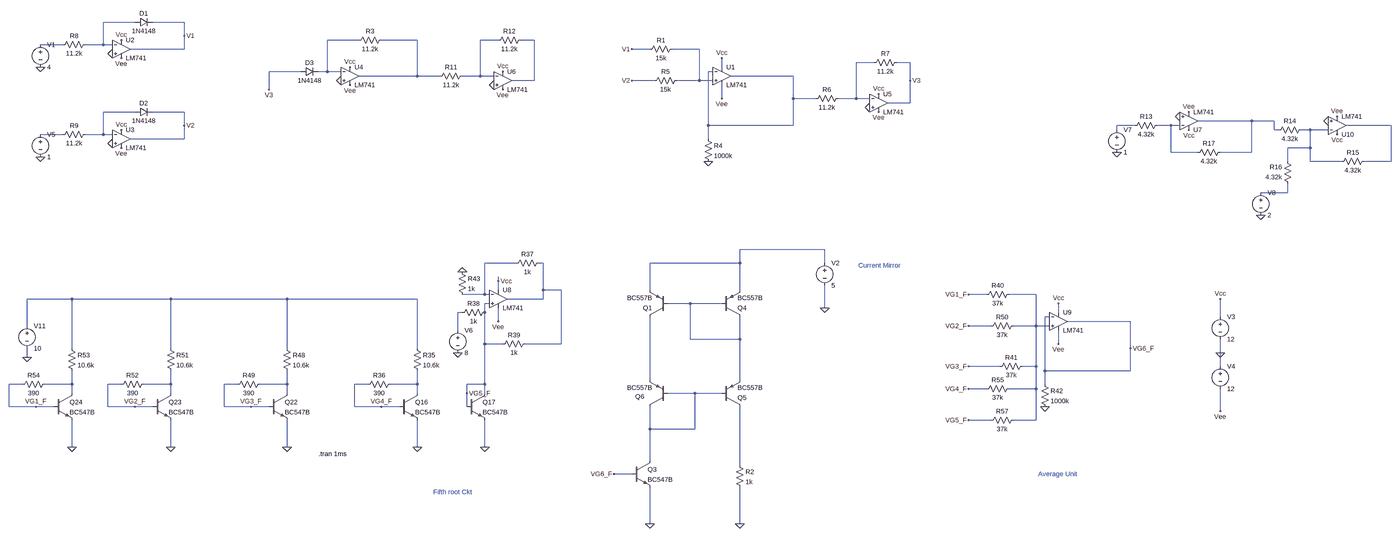
[diagram p0: schematic Nth Root.asc, whole sheet]
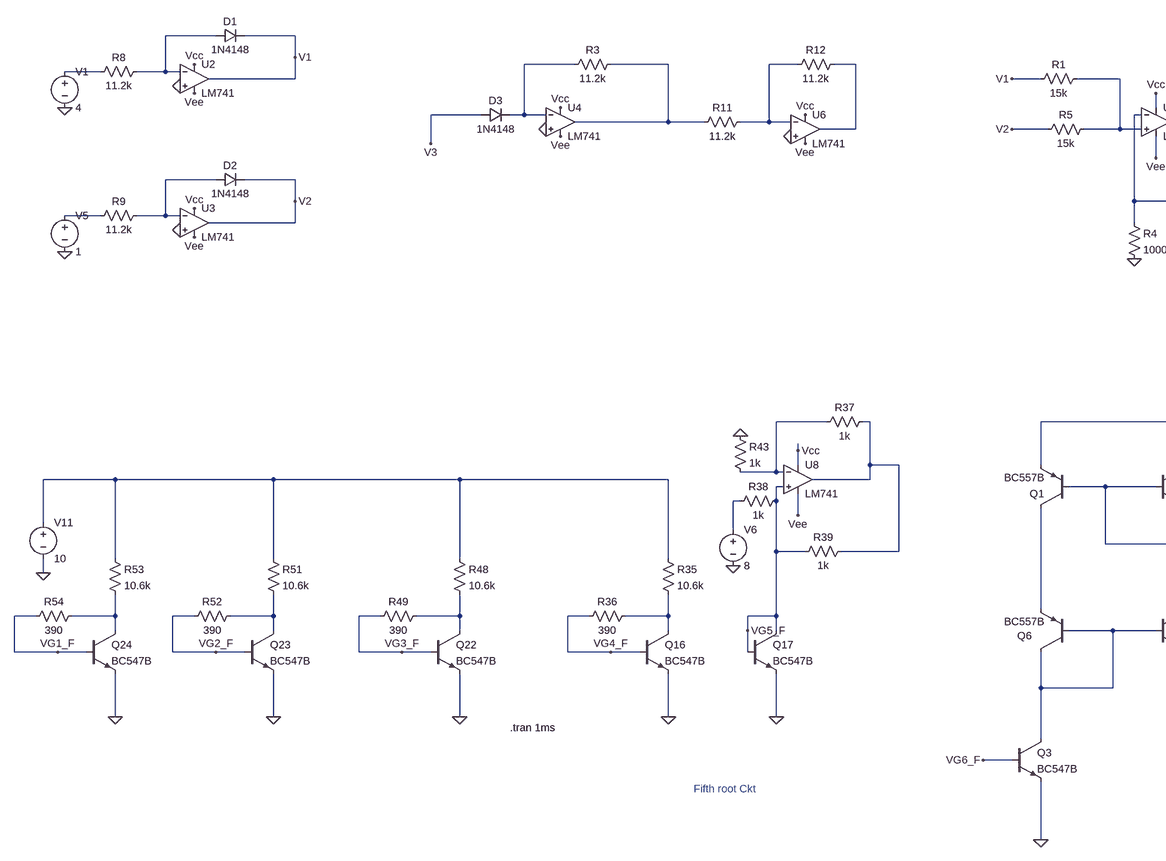
[diagram p1: schematic Nth Root.asc, part, row 1 of 1, column 1 of 2]
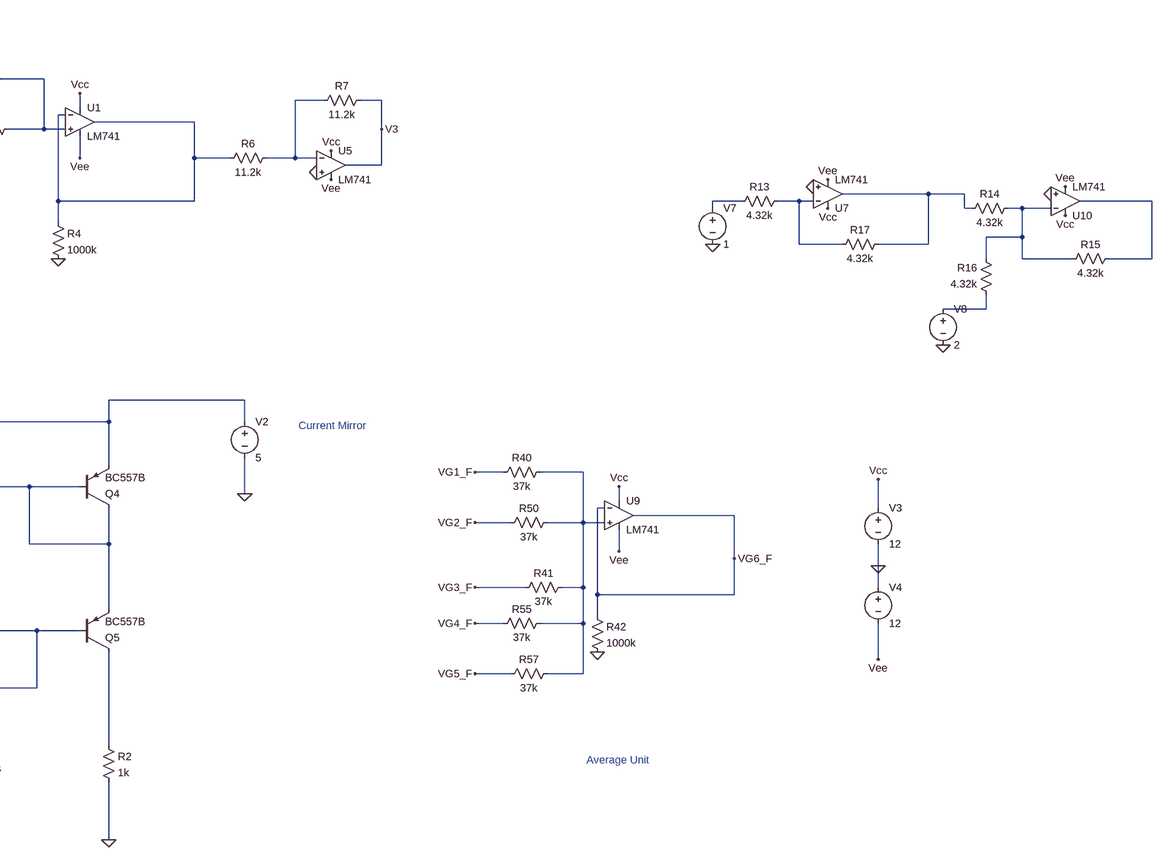
[diagram p2: schematic Nth Root.asc, part, row 1 of 1, column 2 of 2]
Nth Root.asc, the LTspice schematic file:
Version 4
SHEET 1 7272 1028
WIRE -2224 -4416 -2336 -4416
WIRE -2048 -4416 -2160 -4416
WIRE -2048 -4368 -2048 -4416
WIRE -1408 -4352 -1520 -4352
WIRE -1200 -4352 -1328 -4352
WIRE -912 -4352 -976 -4352
WIRE -784 -4352 -832 -4352
WIRE -2480 -4336 -2560 -4336
WIRE -2336 -4336 -2336 -4416
WIRE -2336 -4336 -2400 -4336
WIRE -2304 -4336 -2336 -4336
WIRE -2048 -4320 -2048 -4368
WIRE -2048 -4320 -2240 -4320
WIRE -304 -4320 -368 -4320
WIRE -128 -4320 -224 -4320
WIRE 496 -4272 432 -4272
WIRE 624 -4272 576 -4272
WIRE -48 -4256 -48 -4288
WIRE -1616 -4240 -1728 -4240
WIRE -1520 -4240 -1520 -4352
WIRE -1520 -4240 -1552 -4240
WIRE -1472 -4240 -1520 -4240
WIRE -80 -4240 -96 -4240
WIRE -1200 -4224 -1200 -4352
WIRE -1200 -4224 -1408 -4224
WIRE -1120 -4224 -1200 -4224
WIRE -976 -4224 -976 -4352
WIRE -976 -4224 -1040 -4224
WIRE -928 -4224 -976 -4224
WIRE 208 -4224 -16 -4224
WIRE -784 -4208 -784 -4352
WIRE -784 -4208 -864 -4208
WIRE -288 -4208 -368 -4208
WIRE -128 -4208 -128 -4320
WIRE -128 -4208 -208 -4208
WIRE -80 -4208 -128 -4208
WIRE 624 -4208 624 -4272
WIRE -1728 -4176 -1728 -4240
WIRE -48 -4144 -48 -4192
WIRE 208 -4144 208 -4224
WIRE 288 -4144 208 -4144
WIRE 432 -4144 432 -4272
WIRE 432 -4144 368 -4144
WIRE 480 -4144 432 -4144
WIRE 624 -4128 624 -4208
WIRE 624 -4128 544 -4128
WIRE -2224 -4096 -2336 -4096
WIRE -2048 -4096 -2160 -4096
WIRE 1840 -4064 1648 -4064
WIRE 1920 -4064 1840 -4064
WIRE -2048 -4048 -2048 -4096
WIRE -96 -4048 -96 -4240
WIRE 208 -4048 208 -4144
WIRE 208 -4048 -96 -4048
WIRE 1424 -4048 1360 -4048
WIRE 1552 -4048 1504 -4048
WIRE 1584 -4048 1552 -4048
WIRE 2336 -4048 2176 -4048
WIRE 1360 -4032 1360 -4048
WIRE 1920 -4032 1920 -4064
WIRE 1936 -4032 1920 -4032
WIRE 2048 -4032 2016 -4032
WIRE 2112 -4032 2048 -4032
WIRE -2480 -4016 -2560 -4016
WIRE -2336 -4016 -2336 -4096
WIRE -2336 -4016 -2400 -4016
WIRE -2304 -4016 -2336 -4016
WIRE -2048 -4000 -2048 -4048
WIRE -2048 -4000 -2240 -4000
WIRE -96 -4000 -96 -4048
WIRE 2048 -3968 2048 -4032
WIRE 2048 -3968 1968 -3968
WIRE 1552 -3952 1552 -4048
WIRE 1648 -3952 1552 -3952
WIRE 1840 -3952 1840 -4064
WIRE 1840 -3952 1728 -3952
WIRE 1968 -3920 1968 -3968
WIRE 2048 -3920 2048 -3968
WIRE 2160 -3920 2048 -3920
WIRE 2336 -3920 2336 -4048
WIRE 2336 -3920 2240 -3920
WIRE 1968 -3808 1968 -3840
WIRE 1968 -3808 1872 -3808
WIRE 320 -2912 16 -2912
WIRE -848 -2864 -960 -2864
WIRE -752 -2864 -768 -2864
WIRE 16 -2864 16 -2912
WIRE 16 -2864 -304 -2864
WIRE 320 -2864 320 -2912
WIRE -912 -2800 -912 -2816
WIRE -912 -2768 -912 -2800
WIRE -752 -2768 -752 -2864
WIRE -688 -2768 -752 -2768
WIRE -304 -2768 -304 -2864
WIRE 16 -2768 16 -2864
WIRE -960 -2752 -960 -2864
WIRE -960 -2752 -1040 -2752
WIRE -944 -2752 -960 -2752
WIRE 896 -2752 832 -2752
WIRE 1072 -2752 976 -2752
WIRE -2448 -2736 -2608 -2736
WIRE -2096 -2736 -2448 -2736
WIRE -1664 -2736 -2096 -2736
WIRE -1200 -2736 -1664 -2736
WIRE -752 -2736 -752 -2768
WIRE -752 -2736 -880 -2736
WIRE -944 -2720 -960 -2720
WIRE -160 -2720 -240 -2720
WIRE -48 -2720 -160 -2720
WIRE 320 -2704 320 -2784
WIRE -1040 -2688 -1056 -2688
WIRE -960 -2688 -960 -2720
WIRE 1152 -2688 1152 -2720
WIRE 1120 -2672 1104 -2672
WIRE 1728 -2672 1728 -2736
WIRE -912 -2656 -912 -2704
WIRE 1408 -2656 1184 -2656
WIRE -2608 -2640 -2608 -2736
WIRE 912 -2640 832 -2640
WIRE 1072 -2640 1072 -2752
WIRE 1072 -2640 992 -2640
WIRE 1120 -2640 1072 -2640
WIRE -1056 -2624 -1056 -2688
WIRE -160 -2592 -160 -2720
WIRE 16 -2592 16 -2672
WIRE 16 -2592 -160 -2592
WIRE -960 -2576 -960 -2688
WIRE -896 -2576 -960 -2576
WIRE -688 -2576 -688 -2768
WIRE -688 -2576 -816 -2576
WIRE 1152 -2576 1152 -2624
WIRE -2448 -2560 -2448 -2736
WIRE -2096 -2560 -2096 -2736
WIRE -1664 -2560 -1664 -2736
WIRE -1200 -2560 -1200 -2736
WIRE 1408 -2560 1408 -2656
WIRE 1728 -2544 1728 -2592
WIRE -2608 -2528 -2608 -2560
WIRE 944 -2496 832 -2496
WIRE 1072 -2496 1072 -2640
WIRE 1072 -2496 1024 -2496
WIRE 1728 -2496 1728 -2544
WIRE 1104 -2480 1104 -2672
WIRE 1408 -2480 1408 -2560
WIRE 1408 -2480 1104 -2480
WIRE -304 -2448 -304 -2672
WIRE 16 -2448 16 -2592
WIRE -2624 -2432 -2672 -2432
WIRE -2448 -2432 -2448 -2480
WIRE -2448 -2432 -2544 -2432
WIRE -2272 -2432 -2320 -2432
WIRE -2096 -2432 -2096 -2480
WIRE -2096 -2432 -2192 -2432
WIRE -1840 -2432 -1888 -2432
WIRE -1664 -2432 -1664 -2480
WIRE -1664 -2432 -1760 -2432
WIRE -1376 -2432 -1424 -2432
WIRE -1200 -2432 -1200 -2480
WIRE -1200 -2432 -1296 -2432
WIRE -960 -2432 -960 -2576
WIRE -960 -2432 -1024 -2432
WIRE 1104 -2432 1104 -2480
WIRE 896 -2416 832 -2416
WIRE 1072 -2416 1072 -2496
WIRE 1072 -2416 976 -2416
WIRE -2448 -2400 -2448 -2432
WIRE -2096 -2400 -2096 -2432
WIRE -1664 -2400 -1664 -2432
WIRE -1200 -2400 -1200 -2432
WIRE -1024 -2400 -1024 -2432
WIRE -960 -2400 -960 -2432
WIRE -144 -2400 -240 -2400
WIRE -48 -2400 -144 -2400
WIRE -2672 -2352 -2672 -2432
WIRE -2576 -2352 -2672 -2352
WIRE -2512 -2352 -2576 -2352
WIRE -2320 -2352 -2320 -2432
WIRE -2224 -2352 -2320 -2352
WIRE -2160 -2352 -2224 -2352
WIRE -1888 -2352 -1888 -2432
WIRE -1792 -2352 -1888 -2352
WIRE -1728 -2352 -1792 -2352
WIRE -1424 -2352 -1424 -2432
WIRE -1328 -2352 -1424 -2352
WIRE -1264 -2352 -1328 -2352
WIRE -1024 -2352 -1024 -2400
WIRE 1728 -2336 1728 -2416
WIRE 912 -2304 832 -2304
WIRE 1072 -2304 1072 -2416
WIRE 1072 -2304 992 -2304
WIRE -304 -2272 -304 -2352
WIRE -144 -2272 -144 -2400
WIRE -144 -2272 -304 -2272
WIRE -2448 -2208 -2448 -2304
WIRE -2096 -2208 -2096 -2304
WIRE -1664 -2208 -1664 -2304
WIRE -1200 -2208 -1200 -2304
WIRE -960 -2208 -960 -2304
WIRE -304 -2160 -304 -2272
WIRE 16 -2144 16 -2352
WIRE -368 -2112 -432 -2112
WIRE -304 -1920 -304 -2064
WIRE 16 -1920 16 -2064
FLAG 1728 -2544 0
FLAG 1728 -2736 Vcc
FLAG 1728 -2336 Vee
FLAG -1200 -2208 0
FLAG -1056 -2544 0
FLAG -912 -2800 Vcc
FLAG -912 -2656 Vee
FLAG 1152 -2720 Vcc
FLAG 1152 -2576 Vee
FLAG 1104 -2352 0
FLAG -1040 -2832 0
FLAG -1328 -2352 VG4_F
FLAG 832 -2752 VG1_F
FLAG -1024 -2400 VG5_F
FLAG 832 -2496 VG3_F
FLAG 1408 -2560 VG6_F
FLAG -2608 -2528 0
FLAG -1792 -2352 VG3_F
FLAG -1664 -2208 0
FLAG 832 -2640 VG2_F
FLAG -960 -2208 0
FLAG -2096 -2208 0
FLAG -2224 -2352 VG2_F
FLAG -2448 -2208 0
FLAG -2576 -2352 VG1_F
FLAG 832 -2416 VG4_F
FLAG 832 -2304 VG5_F
FLAG -304 -1920 0
FLAG 16 -1920 0
FLAG 320 -2704 0
FLAG -432 -2112 VG6_F
FLAG -48 -4288 Vcc
FLAG -48 -4144 Vee
FLAG -96 -3920 0
FLAG -368 -4320 V1
FLAG -368 -4208 V2
FLAG -2560 -4256 0
FLAG -2304 -4304 0
FLAG -2272 -4352 Vcc
FLAG -2272 -4288 Vee
FLAG -2560 -3936 0
FLAG -2304 -3984 0
FLAG -2272 -4032 Vcc
FLAG -2272 -3968 Vee
FLAG -2048 -4368 V1
FLAG -2048 -4048 V2
FLAG -1472 -4208 0
FLAG 480 -4112 0
FLAG 512 -4160 Vcc
FLAG 512 -4096 Vee
FLAG 624 -4208 V3
FLAG -1728 -4176 V3
FLAG -1440 -4192 Vee
FLAG -1440 -4256 Vcc
FLAG -928 -4192 0
FLAG -896 -4240 Vcc
FLAG -896 -4176 Vee
FLAG 1360 -3952 0
FLAG 1584 -4080 0
FLAG 2112 -4064 0
FLAG 1872 -3728 0
FLAG 1616 -4096 Vee
FLAG 2144 -4080 Vee
FLAG 1616 -4032 Vcc
FLAG 2144 -4016 Vcc
SYMBOL voltage 1728 -2688 R0
WINDOW 123 0 0 Left 2
WINDOW 39 0 0 Left 2
SYMATTR InstName V3
SYMATTR Value 12
SYMBOL voltage 1728 -2512 R0
WINDOW 123 0 0 Left 2
WINDOW 39 0 0 Left 2
SYMATTR InstName V4
SYMATTR Value 12
SYMBOL npn -1264 -2400 R0
SYMATTR InstName Q16
SYMATTR Value BC547B
SYMBOL npn -1024 -2400 R0
SYMATTR InstName Q17
SYMATTR Value BC547B
SYMBOL res -1216 -2576 R0
SYMATTR InstName R35
SYMATTR Value 10.6k
SYMBOL res -1280 -2448 R90
WINDOW 0 0 56 VBottom 2
WINDOW 3 32 56 VTop 2
SYMATTR InstName R36
SYMATTR Value 390
SYMBOL LM741 -912 -2800 R0
SYMATTR InstName U8
SYMBOL res -752 -2880 R90
WINDOW 0 0 56 VBottom 2
WINDOW 3 32 56 VTop 2
SYMATTR InstName R37
SYMATTR Value 1k
SYMBOL res -944 -2704 R90
WINDOW 0 0 56 VBottom 2
WINDOW 3 32 56 VTop 2
SYMATTR InstName R38
SYMATTR Value 1k
SYMBOL voltage -1056 -2640 R0
WINDOW 123 0 0 Left 2
WINDOW 39 0 0 Left 2
SYMATTR InstName V6
SYMATTR Value 8
SYMBOL res -800 -2592 R90
WINDOW 0 0 56 VBottom 2
WINDOW 3 32 56 VTop 2
SYMATTR InstName R39
SYMATTR Value 1k
SYMBOL res 992 -2768 R90
WINDOW 0 0 56 VBottom 2
WINDOW 3 32 56 VTop 2
SYMATTR InstName R40
SYMATTR Value 37k
SYMBOL res 1040 -2512 R90
WINDOW 0 0 56 VBottom 2
WINDOW 3 32 56 VTop 2
SYMATTR InstName R41
SYMATTR Value 37k
SYMBOL LM741 1152 -2720 R0
SYMATTR InstName U9
SYMBOL res 1088 -2448 R0
SYMATTR InstName R42
SYMATTR Value 1000k
SYMBOL res -1056 -2848 R0
SYMATTR InstName R43
SYMATTR Value 1k
SYMBOL npn -1728 -2400 R0
SYMATTR InstName Q22
SYMATTR Value BC547B
SYMBOL voltage -2608 -2656 R0
WINDOW 123 0 0 Left 2
WINDOW 39 0 0 Left 2
SYMATTR InstName V11
SYMATTR Value 10
SYMBOL res -1680 -2576 R0
SYMATTR InstName R48
SYMATTR Value 10.6k
SYMBOL res -1744 -2448 R90
WINDOW 0 0 56 VBottom 2
WINDOW 3 32 56 VTop 2
SYMATTR InstName R49
SYMATTR Value 390
SYMBOL res 1008 -2656 R90
WINDOW 0 0 56 VBottom 2
WINDOW 3 32 56 VTop 2
SYMATTR InstName R50
SYMATTR Value 37k
SYMBOL npn -2160 -2400 R0
SYMATTR InstName Q23
SYMATTR Value BC547B
SYMBOL res -2112 -2576 R0
SYMATTR InstName R51
SYMATTR Value 10.6k
SYMBOL res -2176 -2448 R90
WINDOW 0 0 56 VBottom 2
WINDOW 3 32 56 VTop 2
SYMATTR InstName R52
SYMATTR Value 390
SYMBOL npn -2512 -2400 R0
SYMATTR InstName Q24
SYMATTR Value BC547B
SYMBOL res -2464 -2576 R0
SYMATTR InstName R53
SYMATTR Value 10.6k
SYMBOL res -2528 -2448 R90
WINDOW 0 0 56 VBottom 2
WINDOW 3 32 56 VTop 2
SYMATTR InstName R54
SYMATTR Value 390
SYMBOL res 992 -2432 R90
WINDOW 0 0 56 VBottom 2
WINDOW 3 32 56 VTop 2
SYMATTR InstName R55
SYMATTR Value 37k
SYMBOL res 1008 -2320 R90
WINDOW 0 0 56 VBottom 2
WINDOW 3 32 56 VTop 2
SYMATTR InstName R57
SYMATTR Value 37k
SYMBOL pnp -240 -2672 R180
SYMATTR InstName Q1
SYMATTR Value BC557B
SYMBOL pnp -48 -2672 M180
SYMATTR InstName Q4
SYMATTR Value BC557B
SYMBOL res 0 -2160 R0
SYMATTR InstName R2
SYMATTR Value 1k
SYMBOL voltage 320 -2880 R0
WINDOW 123 0 0 Left 2
WINDOW 39 0 0 Left 2
SYMATTR InstName V2
SYMATTR Value 5
SYMBOL pnp -48 -2352 M180
SYMATTR InstName Q5
SYMATTR Value BC557B
SYMBOL pnp -240 -2352 R180
WINDOW 0 84 36 Left 2
SYMATTR InstName Q6
SYMATTR Value BC557B
SYMBOL npn -368 -2160 R0
SYMATTR InstName Q3
SYMATTR Value BC547B
SYMBOL res -208 -4336 R90
WINDOW 0 0 56 VBottom 2
WINDOW 3 32 56 VTop 2
SYMATTR InstName R1
SYMATTR Value 15k
SYMBOL LM741 -48 -4288 R0
SYMATTR InstName U1
SYMBOL res -112 -4016 R0
SYMATTR InstName R4
SYMATTR Value 1000k
SYMBOL res -192 -4224 R90
WINDOW 0 0 56 VBottom 2
WINDOW 3 32 56 VTop 2
SYMATTR InstName R5
SYMATTR Value 15k
SYMBOL LM741 -2272 -4384 R0
SYMATTR InstName U2
SYMBOL res -2384 -4352 R90
WINDOW 0 0 56 VBottom 2
WINDOW 3 32 56 VTop 2
SYMATTR InstName R8
SYMATTR Value 11.2k
SYMBOL voltage -2560 -4352 R0
WINDOW 123 0 0 Left 2
WINDOW 39 0 0 Left 2
SYMATTR InstName V1
SYMATTR Value 4
SYMBOL diode -2224 -4400 R270
WINDOW 0 32 32 VTop 2
WINDOW 3 0 32 VBottom 2
SYMATTR InstName D1
SYMATTR Value 1N4148
SYMBOL LM741 -2272 -4064 R0
SYMATTR InstName U3
SYMBOL res -2384 -4032 R90
WINDOW 0 0 56 VBottom 2
WINDOW 3 32 56 VTop 2
SYMATTR InstName R9
SYMATTR Value 11.2k
SYMBOL voltage -2560 -4032 R0
WINDOW 123 0 0 Left 2
WINDOW 39 0 0 Left 2
SYMATTR InstName V5
SYMATTR Value 1
SYMBOL diode -2224 -4080 R270
WINDOW 0 32 32 VTop 2
WINDOW 3 0 32 VBottom 2
SYMATTR InstName D2
SYMATTR Value 1N4148
SYMBOL diode -1616 -4224 R270
WINDOW 0 32 32 VTop 2
WINDOW 3 0 32 VBottom 2
SYMATTR InstName D3
SYMATTR Value 1N4148
SYMBOL LM741 -1440 -4288 R0
SYMATTR InstName U4
SYMBOL res -1312 -4368 R90
WINDOW 0 0 56 VBottom 2
WINDOW 3 32 56 VTop 2
SYMATTR InstName R3
SYMATTR Value 11.2k
SYMBOL LM741 512 -4192 R0
SYMATTR InstName U5
SYMBOL res 384 -4160 R90
WINDOW 0 0 56 VBottom 2
WINDOW 3 32 56 VTop 2
SYMATTR InstName R6
SYMATTR Value 11.2k
SYMBOL res 592 -4288 R90
WINDOW 0 0 56 VBottom 2
WINDOW 3 32 56 VTop 2
SYMATTR InstName R7
SYMATTR Value 11.2k
SYMBOL LM741 -896 -4272 R0
SYMATTR InstName U6
SYMBOL res -1024 -4240 R90
WINDOW 0 0 56 VBottom 2
WINDOW 3 32 56 VTop 2
SYMATTR InstName R11
SYMATTR Value 11.2k
SYMBOL res -816 -4368 R90
WINDOW 0 0 56 VBottom 2
WINDOW 3 32 56 VTop 2
SYMATTR InstName R12
SYMATTR Value 11.2k
SYMBOL res 1520 -4064 R90
WINDOW 0 0 56 VBottom 2
WINDOW 3 32 56 VTop 2
SYMATTR InstName R13
SYMATTR Value 4.32k
SYMBOL voltage 1360 -4048 R0
WINDOW 123 0 0 Left 2
WINDOW 39 0 0 Left 2
SYMATTR InstName V7
SYMATTR Value 1
SYMBOL LM741 1616 -4000 M180
SYMATTR InstName U7
SYMBOL LM741 2144 -3984 M180
SYMATTR InstName U10
SYMBOL res 2032 -4048 R90
WINDOW 0 0 56 VBottom 2
WINDOW 3 32 56 VTop 2
SYMATTR InstName R14
SYMATTR Value 4.32k
SYMBOL res 2256 -3936 R90
WINDOW 0 0 56 VBottom 2
WINDOW 3 32 56 VTop 2
SYMATTR InstName R15
SYMATTR Value 4.32k
SYMBOL res 1984 -3824 R180
WINDOW 0 36 76 Left 2
WINDOW 3 36 40 Left 2
SYMATTR InstName R16
SYMATTR Value 4.32k
SYMBOL voltage 1872 -3824 R0
WINDOW 123 0 0 Left 2
WINDOW 39 0 0 Left 2
SYMATTR InstName V8
SYMATTR Value 2
SYMBOL res 1744 -3968 R90
WINDOW 0 0 56 VBottom 2
WINDOW 3 32 56 VTop 2
SYMATTR InstName R17
SYMATTR Value 4.32k
TEXT -1552 -2184 Left 2 !.tran 1ms
TEXT 1080 -2112 Left 2 ;Average Unit
TEXT -1144 -2048 Left 2 ;Fifth root Ckt
TEXT 440 -2856 Left 2 ;Current Mirror

The netlist it stands for:
* Nth Root.asc
V3 Vcc 0 12
V4 0 Vee 12
Q16 N029 VG4_F 0 0 BC547B
Q17 VG5_F VG5_F 0 0 BC547B
R35 N022 N029 10.6k
R36 N029 VG4_F 390
XU8 VG5_F N019 Vcc Vee N020 LM741  ; pins In+ In- V+ V- OUT
R37 N020 N019 1k
R38 VG5_F N024 1k
V6 N024 0 8
R39 N020 VG5_F 1k
R40 N021 VG1_F 37k
R41 N021 VG3_F 37k
XU9 N021 VG6_F Vcc Vee VG6_F LM741  ; pins In+ In- V+ V- OUT
R42 VG6_F 0 1000k
R43 0 N019 1k
Q22 N028 VG3_F 0 0 BC547B
V11 N022 0 10
R48 N022 N028 10.6k
R49 N028 VG3_F 390
R50 N021 VG2_F 37k
Q23 N027 VG2_F 0 0 BC547B
R51 N022 N027 10.6k
R52 N027 VG2_F 390
Q24 N026 VG1_F 0 0 BC547B
R53 N022 N026 10.6k
R54 N026 VG1_F 390
R55 N021 VG4_F 37k
R57 N021 VG5_F 37k
Q1 N025 N023 N018 0 BC557B
Q4 N023 N023 N018 0 BC557B
R2 N031 0 1k
V2 N018 0 5
Q5 N031 N030 N023 0 BC557B
Q6 N030 N030 N025 0 BC557B
Q3 N030 VG6_F 0 0 BC547B
R1 N007 V1 15k
XU1 N007 N009 Vcc Vee N009 LM741  ; pins In+ In- V+ V- OUT
R4 N009 0 1000k
R5 N007 V2 15k
XU2 0 N001 Vcc Vee V1 LM741  ; pins In+ In- V+ V- OUT
R8 N001 N006 11.2k
V1 N006 0 4
D1 N001 V1 1N4148
XU3 0 N010 Vcc Vee V2 LM741  ; pins In+ In- V+ V- OUT
R9 N010 N016 11.2k
V5 N016 0 1
D2 N010 V2 1N4148
D3 V3 N002 1N4148
XU4 0 N002 Vcc Vee N003 LM741  ; pins In+ In- V+ V- OUT
R3 N003 N002 11.2k
XU5 0 N008 Vcc Vee V3 LM741  ; pins In+ In- V+ V- OUT
R6 N008 N009 11.2k
R7 V3 N008 11.2k
XU6 0 N004 Vcc Vee N005 LM741  ; pins In+ In- V+ V- OUT
R11 N004 N003 11.2k
R12 N005 N004 11.2k
R13 N013 N012 4.32k
V7 N012 0 1
XU7 0 N013 Vcc Vee N011 LM741  ; pins In+ In- V+ V- OUT
XU10 0 N015 Vcc Vee N014 LM741  ; pins In+ In- V+ V- OUT
R14 N015 N011 4.32k
R15 N014 N015 4.32k
R16 N017 N015 4.32k
V8 N017 0 2
R17 N011 N013 4.32k
.model D D
.lib standard.dio
.model NPN NPN
.model PNP PNP
.lib standard.bjt
.tran 1ms
* Average Unit
* Fifth root Ckt
* Current Mirror
.lib LM741.lib
.backanno
.end